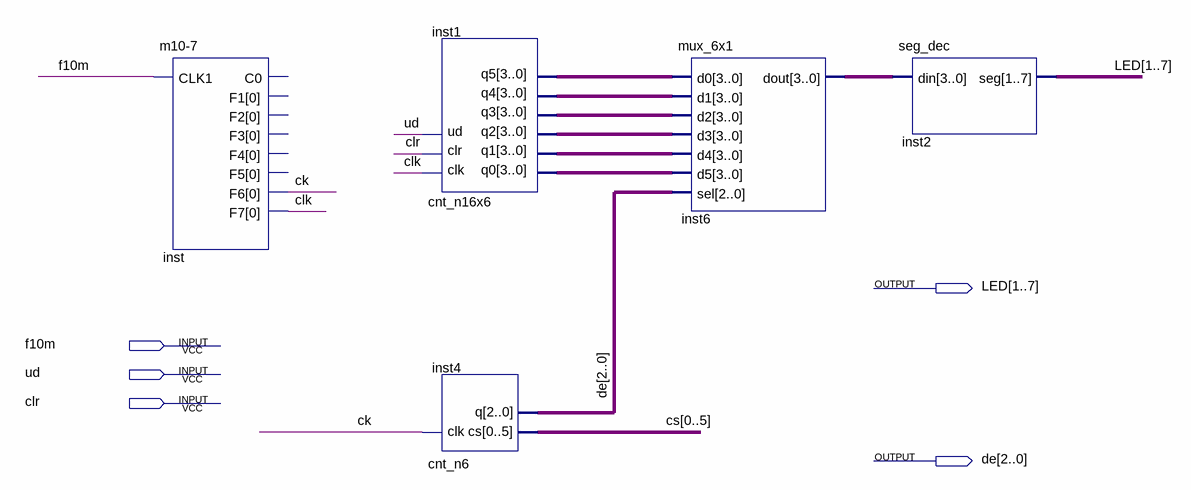
[diagram p0: schematic sheet]
// Quartus schematic TOP.bdf as structural Verilog: 5 symbols, 5 pins
module TOP (
  input  f10m,
  input  ud,
  input  clr,
  output [1:7] LED,
  output [2:0] de
);

  wire ck, clk;
  wire [3:0] inst1_q0, inst1_q1, inst1_q2, inst1_q3, inst1_q4, inst1_q5, inst6_dout;
  wire [5:0] cs;

  \m10-7  inst (.CLK1(f10m), .F6(ck), .F7(clk));  // open: C0, F1, F2, F3, F4, F5
  cnt_n16x6 inst1 (
    .clk(clk), .clr(clr), .ud(ud), .q0(inst1_q0), .q1(inst1_q1), .q2(inst1_q2), .q3(inst1_q3), .q4(inst1_q4),
    .q5(inst1_q5));
  cnt_n6 inst4 (.clk(ck), .cs({cs[0], cs[1], cs[2], cs[3], cs[4], cs[5]}), .q(de));
  mux_6x1 inst6 (
    .d0(inst1_q5), .d1(inst1_q4), .d2(inst1_q3), .d3(inst1_q2), .d4(inst1_q1), .d5(inst1_q0), .sel(de),
    .dout(inst6_dout));
  seg_dec inst2 (.din(inst6_dout), .seg(LED));
endmodule
